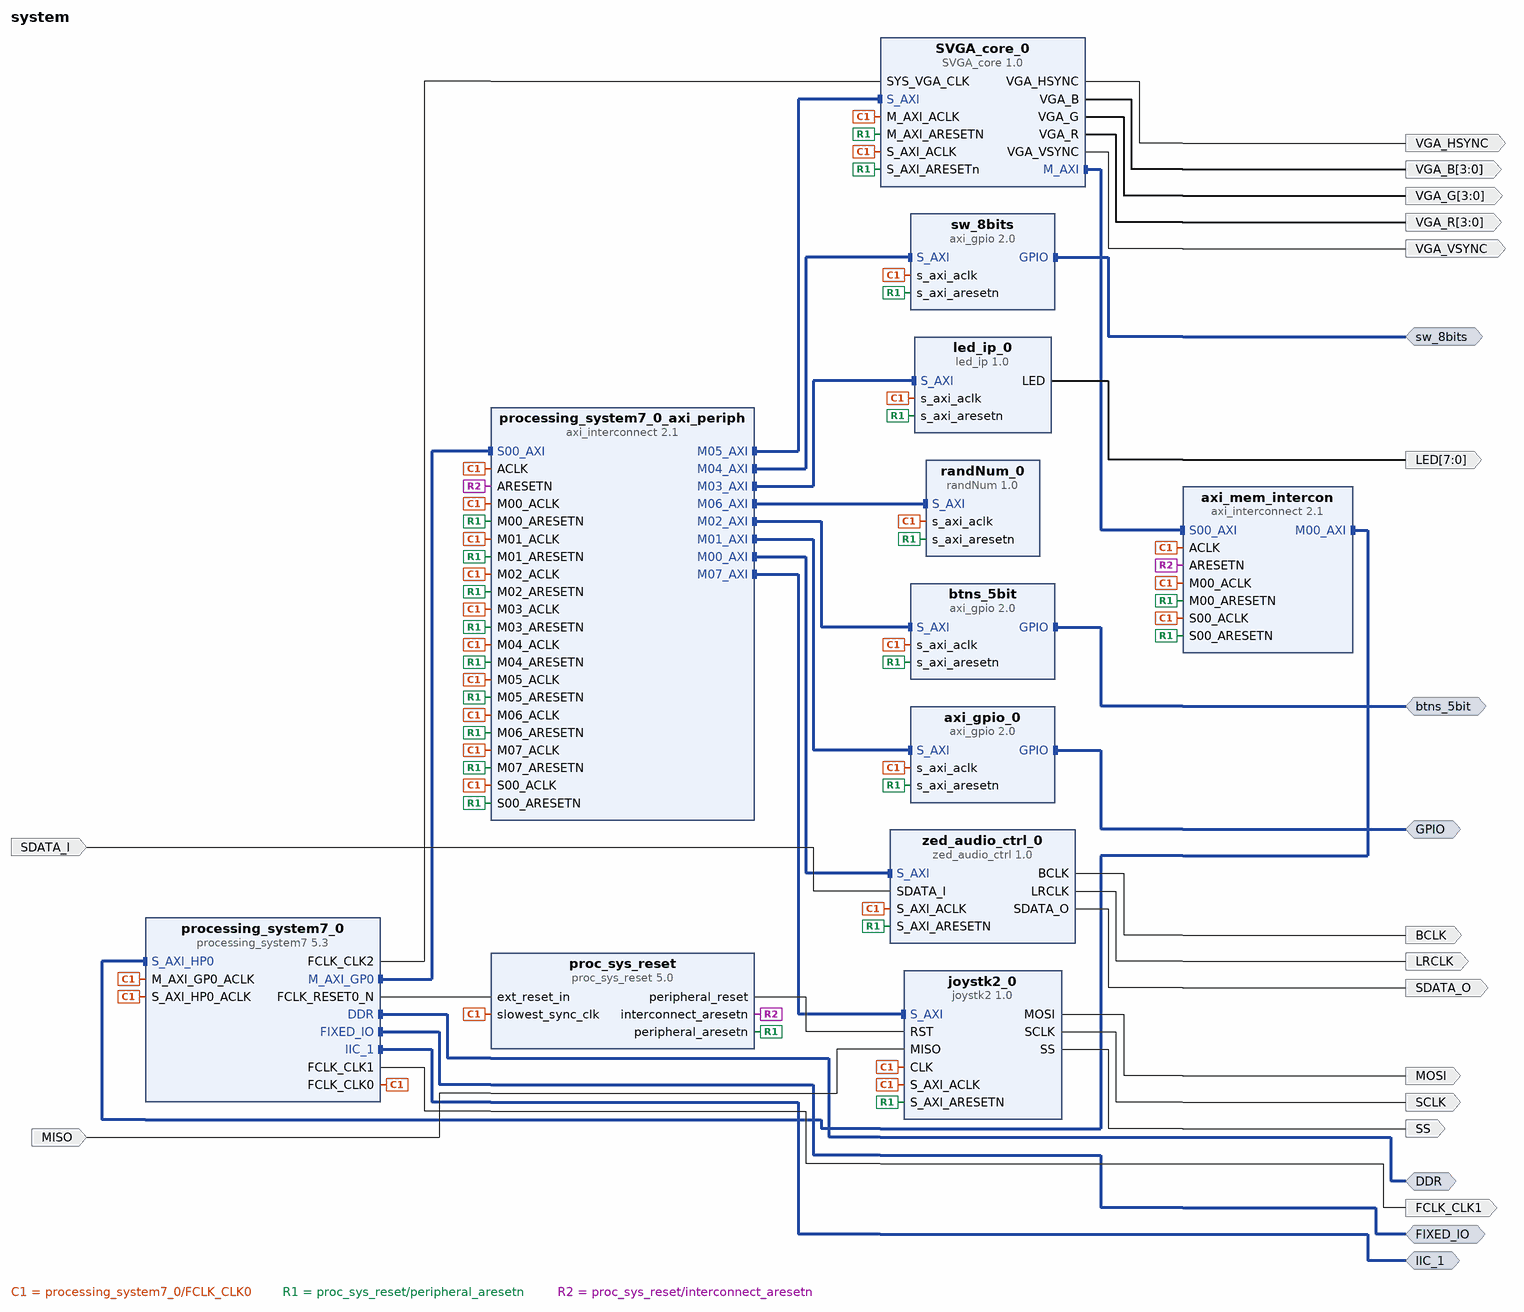
[diagram p0: block diagram of the top level]
# Vivado block design system, Vivado 2013.3
create_bd_design system

create_bd_intf_port -mode Master -vlnv xilinx.com:interface:ddrx_rtl:1.0 DDR
create_bd_intf_port -mode Master -vlnv xilinx.com:display_processing_system7:fixedio_rtl:1.0 FIXED_IO
create_bd_intf_port -mode Master -vlnv xilinx.com:interface:iic_rtl:1.0 IIC_1
create_bd_intf_port -mode Master -vlnv xilinx.com:interface:gpio_rtl:1.0 btns_5bit
create_bd_intf_port -mode Master -vlnv xilinx.com:interface:gpio_rtl:1.0 GPIO
create_bd_intf_port -mode Master -vlnv xilinx.com:interface:gpio_rtl:1.0 sw_8bits
create_bd_port -dir I SDATA_I
create_bd_port -dir O SDATA_O
create_bd_port -dir O BCLK
create_bd_port -dir O LRCLK
create_bd_port -dir O -type clk FCLK_CLK1
create_bd_port -dir O VGA_HSYNC
create_bd_port -dir O VGA_VSYNC
create_bd_port -dir O -from 3 -to 0 VGA_R
create_bd_port -dir O -from 3 -to 0 VGA_G
create_bd_port -dir O -from 3 -to 0 VGA_B
create_bd_port -dir O -from 7 -to 0 LED
create_bd_port -dir I MISO
create_bd_port -dir O SS
create_bd_port -dir O SCLK
create_bd_port -dir O MOSI

create_bd_cell -type ip -vlnv xilinx.com:ip:processing_system7:5.3 processing_system7_0
set_property -dict [list \
  CONFIG.PCW_APU_PERIPHERAL_FREQMHZ 200 \
  CONFIG.PCW_FPGA1_PERIPHERAL_FREQMHZ 8.000000 \
  CONFIG.PCW_FPGA2_PERIPHERAL_FREQMHZ 25 \
  CONFIG.PCW_USE_S_AXI_HP0 1 \
  CONFIG.PCW_EN_CLK1_PORT 1 \
  CONFIG.PCW_EN_CLK2_PORT 1 \
  CONFIG.PCW_I2C1_PERIPHERAL_ENABLE 1 \
  CONFIG.preset {ZedBoard*} \
] [get_bd_cells processing_system7_0]
# 1 more settings of processing_system7_0 are not shown: defaults, MIO pin electricals, DDR timing, and values the tool derives
create_bd_cell -type ip -vlnv xilinx.com:ip:axi_gpio:2.0 axi_gpio_0
set_property -dict {CONFIG.C_GPIO_WIDTH 2 CONFIG.C_IS_DUAL 0} [get_bd_cells axi_gpio_0]
create_bd_cell -type ip -vlnv xilinx.com:user:zed_audio_ctrl:1.0 zed_audio_ctrl_0
create_bd_cell -type ip -vlnv xilinx.com:ip:axi_interconnect:2.1 processing_system7_0_axi_periph
set_property -dict {CONFIG.NUM_MI 8} [get_bd_cells processing_system7_0_axi_periph]
create_bd_cell -type ip -vlnv xilinx.com:ip:proc_sys_reset:5.0 proc_sys_reset
create_bd_cell -type ip -vlnv lab.ensc:user:SVGA_core:1.0 SVGA_core_0
create_bd_cell -type ip -vlnv xilinx.com:ip:axi_interconnect:2.1 axi_mem_intercon
set_property -dict {CONFIG.NUM_MI 1 CONFIG.ENABLE_ADVANCED_OPTIONS 1 CONFIG.XBAR_DATA_WIDTH 64} [get_bd_cells axi_mem_intercon]
create_bd_cell -type ip -vlnv xilinx.com:ip:axi_gpio:2.0 btns_5bit
set_property -dict {CONFIG.C_GPIO_WIDTH 5} [get_bd_cells btns_5bit]
create_bd_cell -type ip -vlnv xilinx.com:user:led_ip:1.0 led_ip_0
create_bd_cell -type ip -vlnv xilinx.com:ip:axi_gpio:2.0 sw_8bits
set_property -dict {CONFIG.C_GPIO_WIDTH 8} [get_bd_cells sw_8bits]
create_bd_cell -type ip -vlnv lab.ensc:user:joystk2:1.0 joystk2_0
create_bd_cell -type ip -vlnv xilinx.com:user:randNum:1.0 randNum_0

# ---- connections ----

connect_bd_intf_net [get_bd_intf_pins processing_system7_0/M_AXI_GP0] [get_bd_intf_pins processing_system7_0_axi_periph/S00_AXI]
connect_bd_intf_net [get_bd_intf_pins processing_system7_0_axi_periph/M00_AXI] [get_bd_intf_pins zed_audio_ctrl_0/S_AXI]
connect_bd_intf_net [get_bd_intf_pins processing_system7_0_axi_periph/M01_AXI] [get_bd_intf_pins axi_gpio_0/S_AXI]
connect_bd_intf_net [get_bd_intf_pins SVGA_core_0/M_AXI] [get_bd_intf_pins axi_mem_intercon/S00_AXI]
connect_bd_intf_net [get_bd_intf_pins axi_mem_intercon/M00_AXI] [get_bd_intf_pins processing_system7_0/S_AXI_HP0]
connect_bd_intf_net [get_bd_intf_pins processing_system7_0_axi_periph/M02_AXI] [get_bd_intf_pins btns_5bit/S_AXI]
connect_bd_intf_net [get_bd_intf_pins processing_system7_0_axi_periph/M03_AXI] [get_bd_intf_pins led_ip_0/S_AXI]
connect_bd_intf_net [get_bd_intf_pins processing_system7_0_axi_periph/M04_AXI] [get_bd_intf_pins sw_8bits/S_AXI]
connect_bd_intf_net [get_bd_intf_pins processing_system7_0_axi_periph/M05_AXI] [get_bd_intf_pins SVGA_core_0/S_AXI]
connect_bd_intf_net [get_bd_intf_pins processing_system7_0_axi_periph/M07_AXI] [get_bd_intf_pins joystk2_0/S_AXI]
connect_bd_intf_net [get_bd_intf_pins processing_system7_0_axi_periph/M06_AXI] [get_bd_intf_pins randNum_0/S_AXI]
connect_bd_intf_net [get_bd_intf_ports DDR] [get_bd_intf_pins processing_system7_0/DDR]
connect_bd_intf_net [get_bd_intf_ports FIXED_IO] [get_bd_intf_pins processing_system7_0/FIXED_IO]
connect_bd_intf_net [get_bd_intf_ports IIC_1] [get_bd_intf_pins processing_system7_0/IIC_1]
connect_bd_intf_net -intf_net axi_gpio_1_gpio [get_bd_intf_ports btns_5bit] [get_bd_intf_pins btns_5bit/GPIO]
connect_bd_intf_net [get_bd_intf_ports GPIO] [get_bd_intf_pins axi_gpio_0/GPIO]
connect_bd_intf_net [get_bd_intf_ports sw_8bits] [get_bd_intf_pins sw_8bits/GPIO]
connect_bd_net [get_bd_pins processing_system7_0/FCLK_CLK0] \
  [get_bd_pins processing_system7_0/M_AXI_GP0_ACLK] [get_bd_pins processing_system7_0_axi_periph/S00_ACLK] \
  [get_bd_pins processing_system7_0_axi_periph/ACLK] [get_bd_pins zed_audio_ctrl_0/S_AXI_ACLK] \
  [get_bd_pins processing_system7_0_axi_periph/M00_ACLK] [get_bd_pins axi_gpio_0/s_axi_aclk] \
  [get_bd_pins processing_system7_0_axi_periph/M01_ACLK] [get_bd_pins proc_sys_reset/slowest_sync_clk] \
  [get_bd_pins SVGA_core_0/M_AXI_ACLK] [get_bd_pins axi_mem_intercon/S00_ACLK] [get_bd_pins axi_mem_intercon/ACLK] \
  [get_bd_pins processing_system7_0/S_AXI_HP0_ACLK] [get_bd_pins axi_mem_intercon/M00_ACLK] \
  [get_bd_pins SVGA_core_0/S_AXI_ACLK] [get_bd_pins btns_5bit/s_axi_aclk] \
  [get_bd_pins processing_system7_0_axi_periph/M02_ACLK] [get_bd_pins led_ip_0/s_axi_aclk] \
  [get_bd_pins processing_system7_0_axi_periph/M03_ACLK] [get_bd_pins sw_8bits/s_axi_aclk] \
  [get_bd_pins processing_system7_0_axi_periph/M04_ACLK] [get_bd_pins processing_system7_0_axi_periph/M05_ACLK] \
  [get_bd_pins processing_system7_0_axi_periph/M06_ACLK] [get_bd_pins joystk2_0/CLK] \
  [get_bd_pins processing_system7_0_axi_periph/M07_ACLK] [get_bd_pins joystk2_0/S_AXI_ACLK] \
  [get_bd_pins randNum_0/s_axi_aclk]
connect_bd_net [get_bd_pins proc_sys_reset/peripheral_aresetn] \
  [get_bd_pins processing_system7_0_axi_periph/S00_ARESETN] [get_bd_pins zed_audio_ctrl_0/S_AXI_ARESETN] \
  [get_bd_pins processing_system7_0_axi_periph/M00_ARESETN] [get_bd_pins axi_gpio_0/s_axi_aresetn] \
  [get_bd_pins processing_system7_0_axi_periph/M01_ARESETN] [get_bd_pins SVGA_core_0/M_AXI_ARESETN] \
  [get_bd_pins axi_mem_intercon/S00_ARESETN] [get_bd_pins axi_mem_intercon/M00_ARESETN] \
  [get_bd_pins SVGA_core_0/S_AXI_ARESETn] [get_bd_pins btns_5bit/s_axi_aresetn] \
  [get_bd_pins processing_system7_0_axi_periph/M02_ARESETN] [get_bd_pins led_ip_0/s_axi_aresetn] \
  [get_bd_pins processing_system7_0_axi_periph/M03_ARESETN] [get_bd_pins sw_8bits/s_axi_aresetn] \
  [get_bd_pins processing_system7_0_axi_periph/M04_ARESETN] [get_bd_pins processing_system7_0_axi_periph/M05_ARESETN] \
  [get_bd_pins processing_system7_0_axi_periph/M06_ARESETN] [get_bd_pins processing_system7_0_axi_periph/M07_ARESETN] \
  [get_bd_pins joystk2_0/S_AXI_ARESETN] [get_bd_pins randNum_0/s_axi_aresetn]
connect_bd_net [get_bd_pins proc_sys_reset/interconnect_aresetn] \
  [get_bd_pins processing_system7_0_axi_periph/ARESETN] [get_bd_pins axi_mem_intercon/ARESETN]
connect_bd_net [get_bd_pins processing_system7_0/FCLK_RESET0_N] [get_bd_pins proc_sys_reset/ext_reset_in]
connect_bd_net [get_bd_ports SDATA_I] [get_bd_pins zed_audio_ctrl_0/SDATA_I]
connect_bd_net [get_bd_pins zed_audio_ctrl_0/SDATA_O] [get_bd_ports SDATA_O]
connect_bd_net [get_bd_pins zed_audio_ctrl_0/BCLK] [get_bd_ports BCLK]
connect_bd_net [get_bd_pins zed_audio_ctrl_0/LRCLK] [get_bd_ports LRCLK]
connect_bd_net [get_bd_pins processing_system7_0/FCLK_CLK1] [get_bd_ports FCLK_CLK1]
connect_bd_net [get_bd_pins SVGA_core_0/VGA_HSYNC] [get_bd_ports VGA_HSYNC]
connect_bd_net [get_bd_pins SVGA_core_0/VGA_VSYNC] [get_bd_ports VGA_VSYNC]
connect_bd_net [get_bd_pins SVGA_core_0/VGA_R] [get_bd_ports VGA_R]
connect_bd_net [get_bd_pins SVGA_core_0/VGA_G] [get_bd_ports VGA_G]
connect_bd_net [get_bd_pins SVGA_core_0/VGA_B] [get_bd_ports VGA_B]
connect_bd_net [get_bd_pins led_ip_0/LED] [get_bd_ports LED]
connect_bd_net [get_bd_pins processing_system7_0/FCLK_CLK2] [get_bd_pins SVGA_core_0/SYS_VGA_CLK]
connect_bd_net [get_bd_pins proc_sys_reset/peripheral_reset] [get_bd_pins joystk2_0/RST]
connect_bd_net [get_bd_ports MISO] [get_bd_pins joystk2_0/MISO]
connect_bd_net [get_bd_pins joystk2_0/SS] [get_bd_ports SS]
connect_bd_net [get_bd_pins joystk2_0/SCLK] [get_bd_ports SCLK]
connect_bd_net [get_bd_pins joystk2_0/MOSI] [get_bd_ports MOSI]

# ---- address map ----
assign_bd_address -offset 0x41200000 -range 64K -target_address_space [get_bd_addr_spaces processing_system7_0/Data] [get_bd_addr_segs axi_gpio_0/S_AXI/Reg]
assign_bd_address -offset 0x41210000 -range 64K -target_address_space [get_bd_addr_spaces processing_system7_0/Data] [get_bd_addr_segs btns_5bit/S_AXI/Reg]
assign_bd_address -offset 0x41220000 -range 64K -target_address_space [get_bd_addr_spaces processing_system7_0/Data] [get_bd_addr_segs sw_8bits/S_AXI/Reg]
assign_bd_address -offset 0x43C00000 -range 64K -target_address_space [get_bd_addr_spaces processing_system7_0/Data] [get_bd_addr_segs zed_audio_ctrl_0/S_AXI/reg0]
assign_bd_address -offset 0x43C10000 -range 4K -target_address_space [get_bd_addr_spaces processing_system7_0/Data] [get_bd_addr_segs led_ip_0/S_AXI/S_AXI_reg]
assign_bd_address -offset 0x43C11000 -range 4K -target_address_space [get_bd_addr_spaces processing_system7_0/Data] [get_bd_addr_segs randNum_0/S_AXI/S_AXI_reg]
assign_bd_address -offset 0x43C20000 -range 64K -target_address_space [get_bd_addr_spaces processing_system7_0/Data] [get_bd_addr_segs joystk2_0/S_AXI/reg0]
assign_bd_address -offset 0x60000000 -range 512M -target_address_space [get_bd_addr_spaces processing_system7_0/Data] [get_bd_addr_segs SVGA_core_0/S_AXI/reg0]
assign_bd_address -offset 0x00000000 -range 512M -target_address_space [get_bd_addr_spaces SVGA_core_0/M_AXI] [get_bd_addr_segs processing_system7_0/S_AXI_HP0/HP0_DDR_LOWOCM]

validate_bd_design
save_bd_design
